# EasyEDA schematic SCH_usb-hub.json
TITLE: USB-HUB : USB-A to 2*USB-A, USB-C, MICRO-USB; REV: 1.0; Date: 2024-08-25; Sheet: 1/1; Drawn By: romainmza
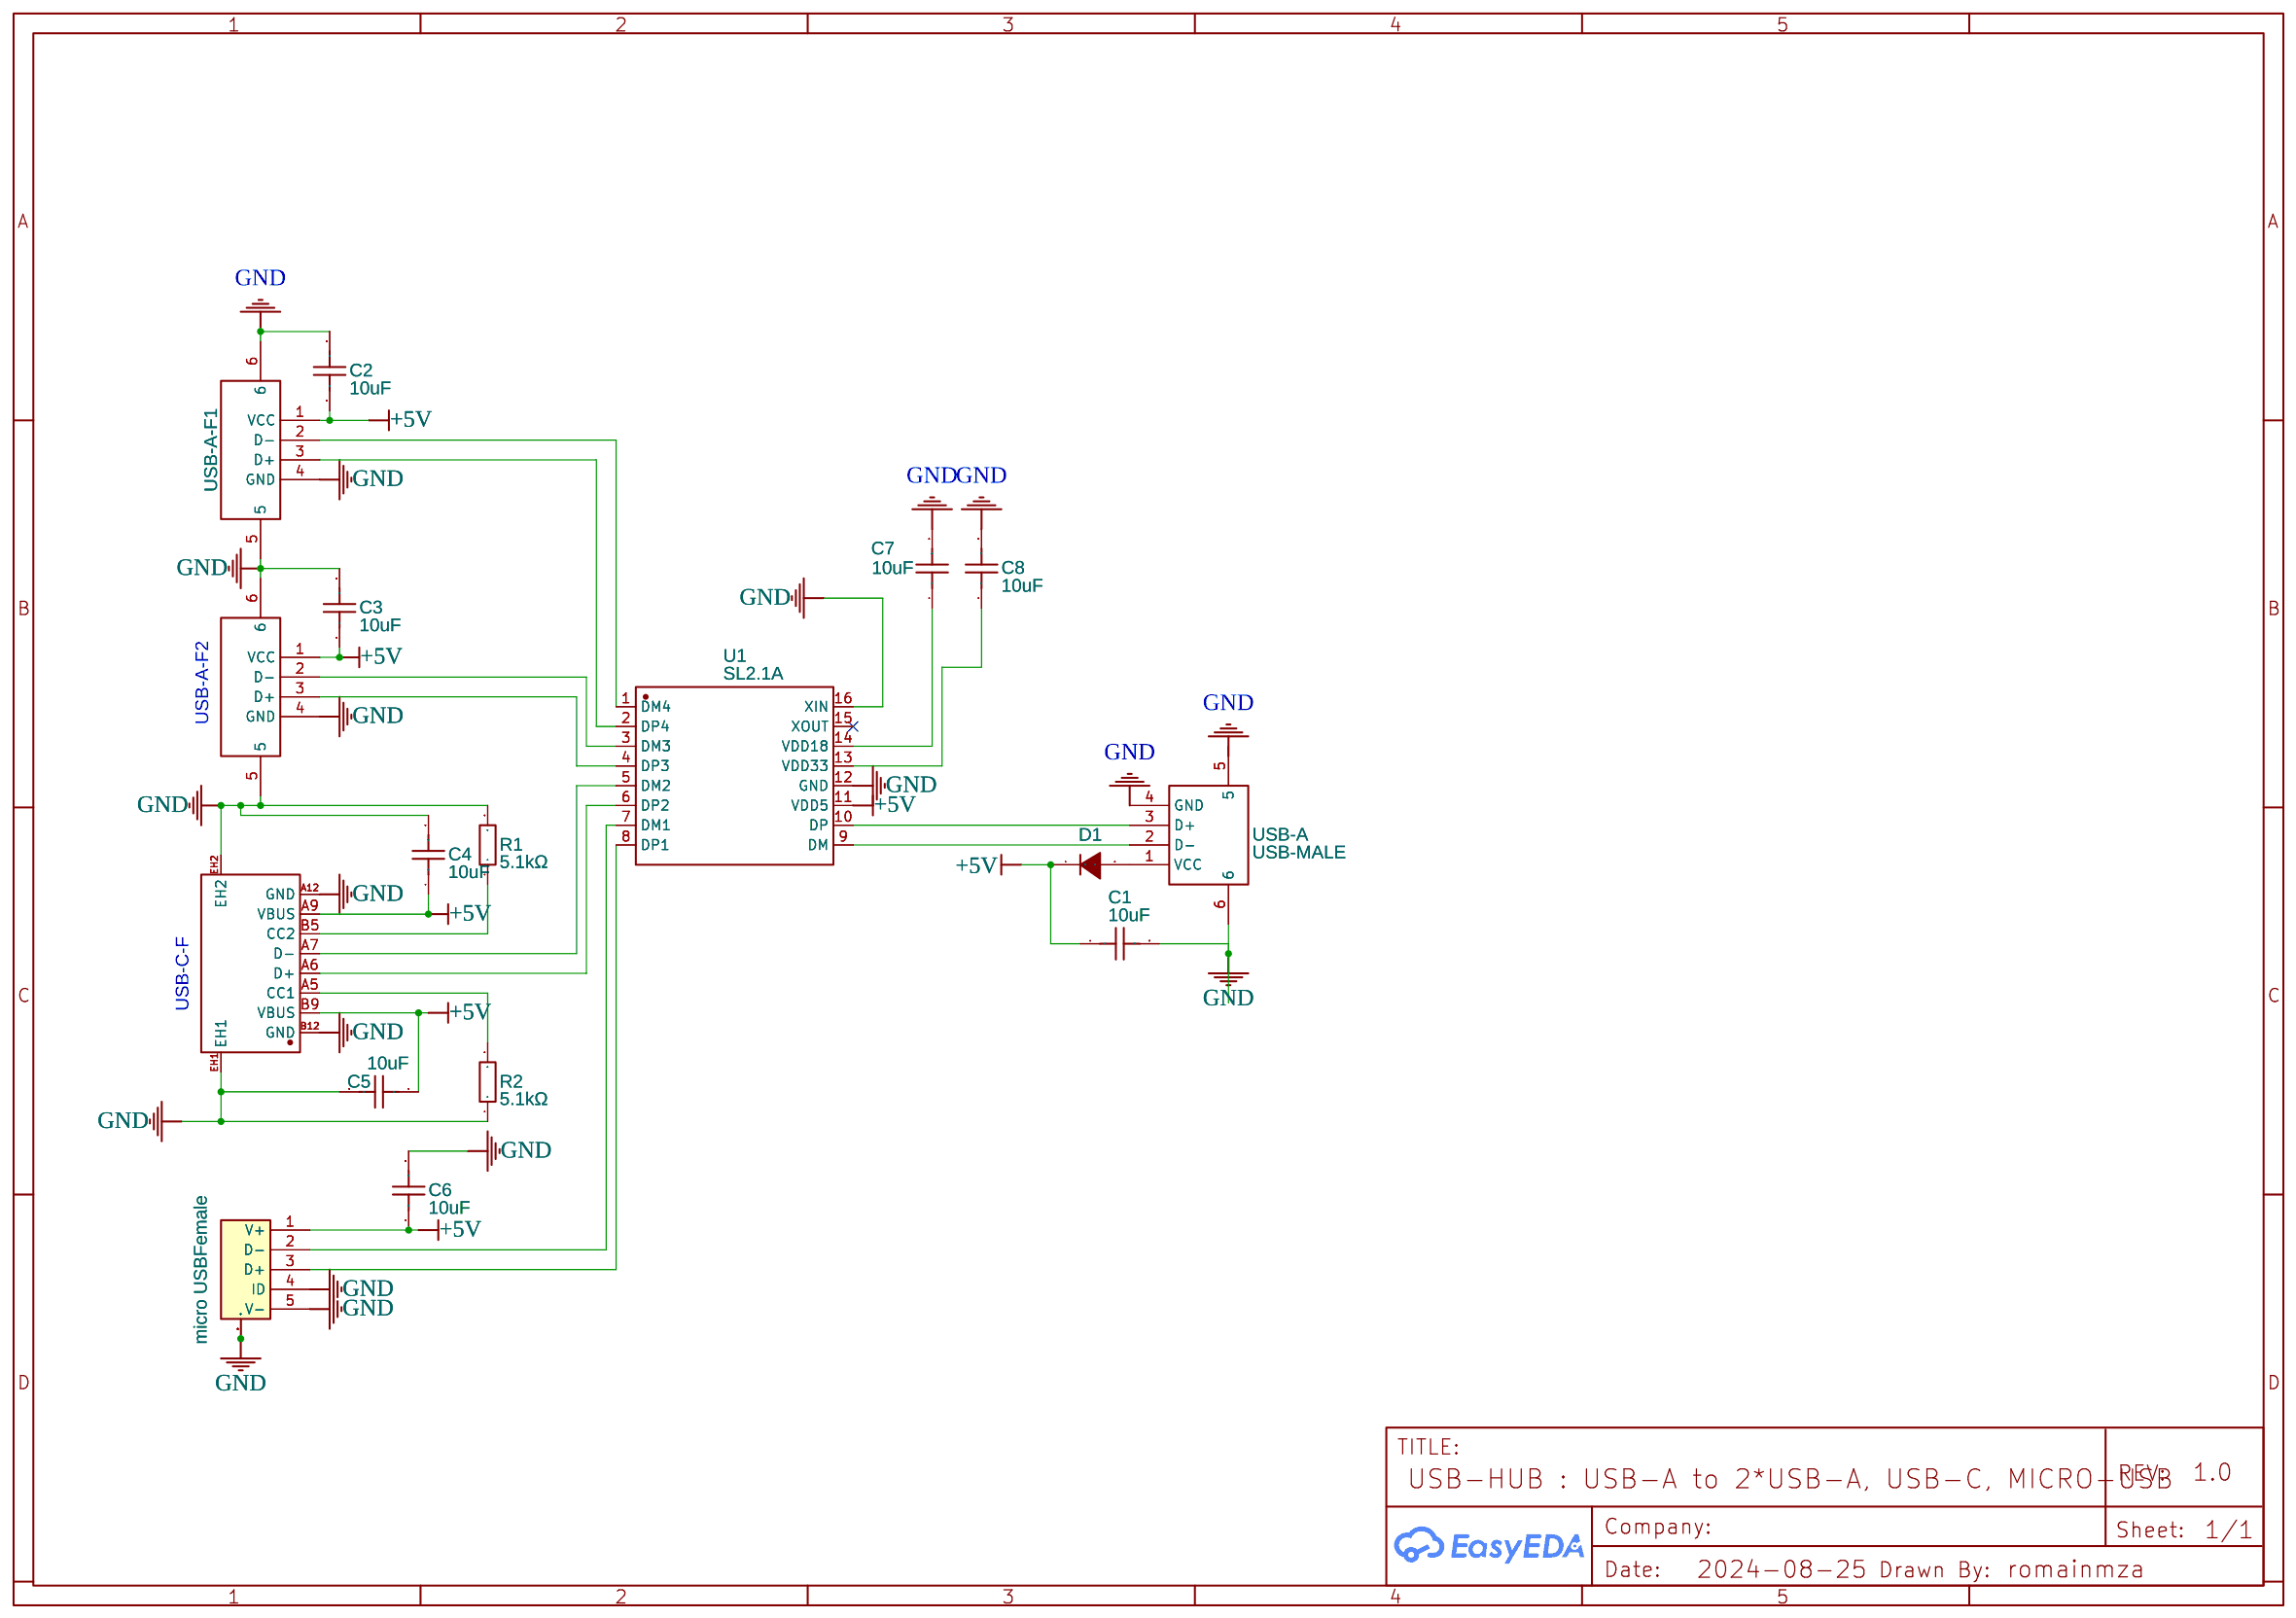
[diagram p0: schematic sheet]

## Parts
C1  10uF  [C0603]
C2  10uF  [C0603]
C3  10uF  [C0603]
C4  10uF  [C0603]
C5  10uF  [C0603]
C6  10uF  [C0603]
C7  10uF  [C0603]
C8  10uF  [C0603]
D1  NSR0320MW2T1G  [SOD-323_L1.8-W1.3-LS2.5-RD]
R1  5.1kΩ  [R0402]
R2  5.1kΩ  [R0402]
U1  SL2.1A  [SOP-16_L10.0-W3.9-P1.27-LS6.0-BL]
USB1  micro USBFemale  [MICRO-USB-SMD_5P-P0.65-H-F_C10418]
USB2  GT-USB-7100A  [USB-C-SMD_GT-USB-7100A]
USB3  AF-90  [USB-A-TH_C46407]
USB-A  USB-MALE  [USB-A-TH_U-G-04WD-W-01]
USB-A-F1  AF-90  [USB-A-TH_C46407]

## Library data of the parts
C1-C8 = CL10A106KP8NNNC: Supplier: LCSC; Manufacturer: SAMSUNG(三星); Supplier Part: C19702; JLCPCB Part Class: Basic Part
D1 = NSR0320MW2T1G: Supplier: LCSC; Manufacturer: onsemi(安森美); Supplier Part: C48192; JLCPCB Part Class: Extended Part
R1 R2 = 0402WGF5101TCE: Supplier: LCSC; Manufacturer: UNI-ROYAL(厚声); Supplier Part: C25905; JLCPCB Part Class: Basic Part
U1 = SL2.1A: Contributor: LCSC; Supplier: LCSC; Supplier Part: C192893; Manufacturer: CoreChips(和芯润德); JLCPCB Part Class: Extended Part
USB1 = micro USBFemale: Supplier: LCSC; Manufacturer: 精拓金; Manufacturer Part: 920-E52A2021S10100; Supplier Part: C10418; JLCPCB Part Class: Extended Part
USB2 = GT-USB-7100A: Supplier: LCSC; Supplier Part: C7469646; Manufacturer: G-Switch(品赞); JLCPCB Part Class: Extended Part; Contributor: lcsc
USB3 USB-A-F1 = USB-AF-90-14.4X13.6-H7.0-DIP: Contributor: LCSC; Supplier: LCSC; Supplier Part: C46407; Manufacturer: 精拓金; Manufacturer Part: 903-131A1011D10100; JLCPCB Part Class: Extended Part
USB-A = U-G-04DD-W-01: Supplier: LCSC; Manufacturer: 韩国韩荣; Manufacturer Part: U-G-O4DD-W-1; Supplier Part: C98125; JLCPCB Part Class: Extended Part

## Nets
+5V: C1.1 C2.1 C3.1 C4.1 C5.1 C6.1 D1.1(C) U1.11(VDD5) USB1.1(V+) USB2.A9(VBUS) USB2.B9(VBUS) USB3.1(VCC) USB-A-F1.1(VCC)
GND: C1.2 C2.2 C3.2 C4.2 C5.2 C6.2 C7.2 C8.2 R1.2 R2.1 U1.12(GND) U1.16(XIN) USB1.4(ID) USB1.5(V-) USB1.SH0(MTN) USB1.SH1(1) USB1.SH2(2) USB1.SH3(3) USB2.A12(GND) USB2.B12(GND) USB2.EH1 USB2.EH2 USB3.4(GND) USB3.5 USB3.6 USB-A.4(GND) USB-A.5 USB-A.6 USB-A-F1.4(GND) USB-A-F1.5 USB-A-F1.6
Net-(C7-1): C7.1 U1.14(VDD18)
Net-(C8-1): C8.1 U1.13(VDD33)
Net-(D1-2): D1.2(A) USB-A.1(VCC)
Net-(R1-1): R1.1 USB2.B5(CC2)
Net-(R2-2): R2.2 USB2.A5(CC1)
Net-(U1-1): U1.1(DM4) USB-A-F1.2(D-)
Net-(U1-2): U1.2(DP4) USB-A-F1.3(D+)
Net-(U1-3): U1.3(DM3) USB3.2(D-)
Net-(U1-4): U1.4(DP3) USB3.3(D+)
Net-(U1-5): U1.5(DM2) USB2.A7(D-)
Net-(U1-6): U1.6(DP2) USB2.A6(D+)
Net-(U1-7): U1.7(DM1) USB1.2(D-)
Net-(U1-8): U1.8(DP1) USB1.3(D+)
Net-(U1-9): U1.9(DM) USB-A.2(D-)
Net-(U1-10): U1.10(DP) USB-A.3(D+)

Not connected (* = marked no-connect by the designer): U1 15(XOUT)*

## Notes on the sheet
- USB-A-F2
- USB-C-F
